# EAGLE schematic TriggerBoardv2 (EAGLE 6.5.0)
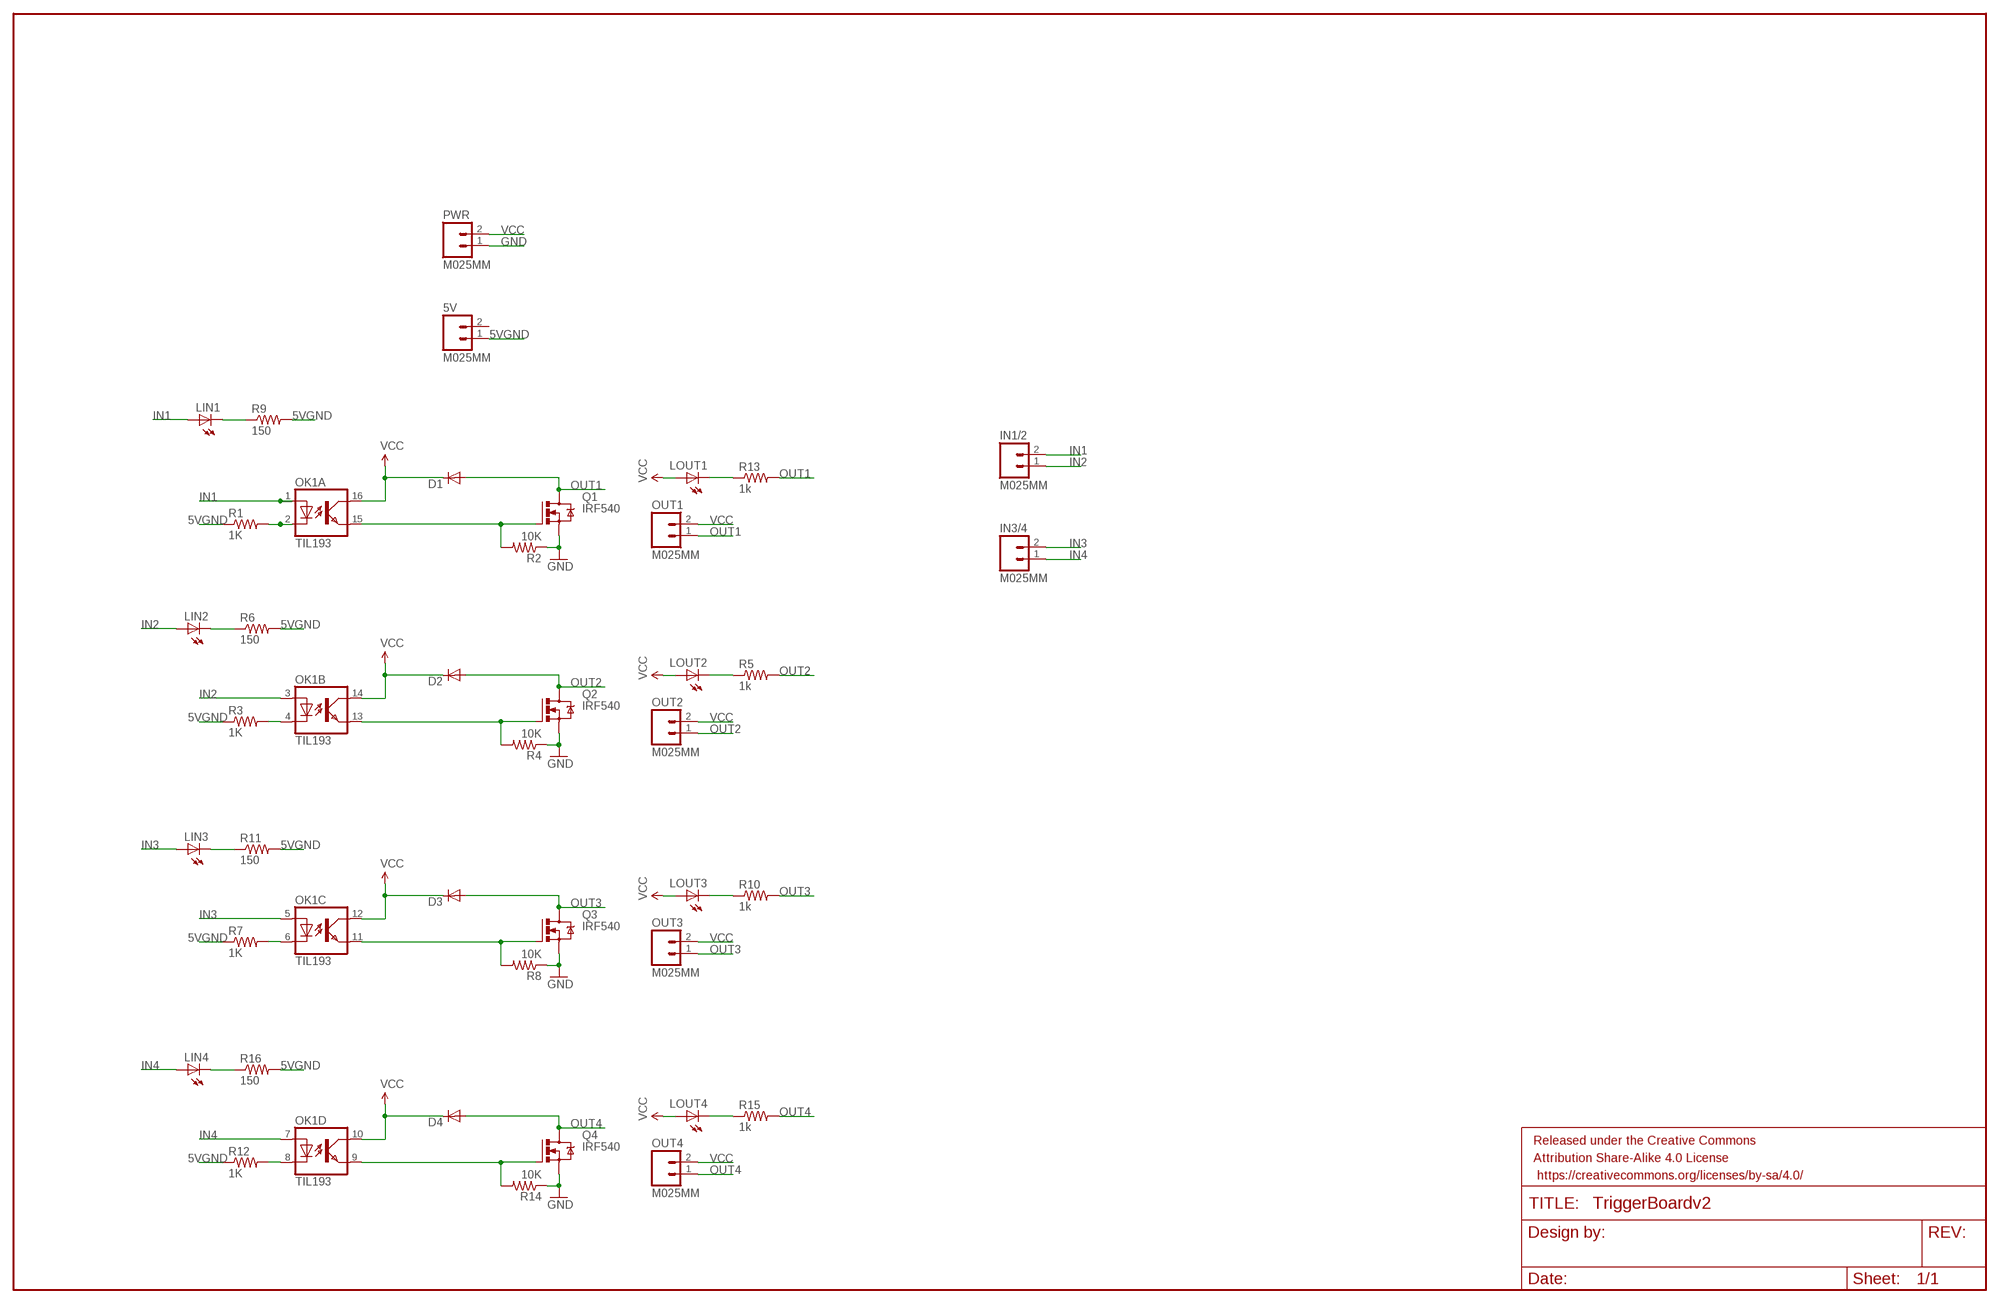
[diagram p0: schematic, sheet 1]

## Parts
5V  M025MM  [SCREWTERMINAL-5MM-2]
D1  DIODEPTH  [DIODE-1N4001]
D2  DIODEPTH  [DIODE-1N4001]
D3  DIODEPTH  [DIODE-1N4001]
D4  DIODEPTH  [DIODE-1N4001]
FRAME1  FRAME-LEDGER  [CREATIVE_COMMONS]
IN1/2  M025MM  [SCREWTERMINAL-5MM-2]
IN3/4  M025MM  [SCREWTERMINAL-5MM-2]
LIN1  LED3MM  [LED3MM]
LIN2  LED3MM  [LED3MM]
LIN3  LED3MM  [LED3MM]
LIN4  LED3MM  [LED3MM]
LOUT1  LED3MM  [LED3MM]
LOUT2  LED3MM  [LED3MM]
LOUT3  LED3MM  [LED3MM]
LOUT4  LED3MM  [LED3MM]
OK1  TIL193  [DIL16]
OUT1  M025MM  [SCREWTERMINAL-5MM-2]
OUT2  M025MM  [SCREWTERMINAL-5MM-2]
OUT3  M025MM  [SCREWTERMINAL-5MM-2]
OUT4  M025MM  [SCREWTERMINAL-5MM-2]
PWR  M025MM  [SCREWTERMINAL-5MM-2]
Q1  IRF540  [TO220BV]
Q2  IRF540  [TO220BV]
Q3  IRF540  [TO220BV]
Q4  IRF540  [TO220BV]
R1  1K  RESISTORPTH-1/4W  [AXIAL-0.4]
R2  10K  RESISTORPTH-1/4W  [AXIAL-0.4]
R3  1K  RESISTORPTH-1/4W  [AXIAL-0.4]
R4  10K  RESISTORPTH-1/4W  [AXIAL-0.4]
R5  1k  RESISTORPTH-1/4W  [AXIAL-0.4]
R6  150  RESISTORPTH-1/4W  [AXIAL-0.4]
R7  1K  RESISTORPTH-1/4W  [AXIAL-0.4]
R8  10K  RESISTORPTH-1/4W  [AXIAL-0.4]
R9  150  RESISTORPTH-1/4W  [AXIAL-0.4]
R10  1k  RESISTORPTH-1/4W  [AXIAL-0.4]
R11  150  RESISTORPTH-1/4W  [AXIAL-0.4]
R12  1K  RESISTORPTH-1/4W  [AXIAL-0.4]
R13  1k  RESISTORPTH-1/4W  [AXIAL-0.4]
R14  10K  RESISTORPTH-1/4W  [AXIAL-0.4]
R15  1k  RESISTORPTH-1/4W  [AXIAL-0.4]
R16  150  RESISTORPTH-1/4W  [AXIAL-0.4]

## Nets
5VGND: 5V.1 R1.P$1 R3.P$1 R6.P$2 R7.P$1 R9.P$2 R11.P$2 R12.P$1 R16.P$2
GND: PWR.1 Q1.S Q2.S Q3.S Q4.S R2.P$1 R4.P$1 R8.P$1 R14.P$1
IN1: IN1/2.2 LIN1.A OK1.1(A:A)
IN2: IN1/2.1 LIN2.A OK1.3(B:A)
IN3: IN3/4.2 LIN3.A OK1.5(C:A)
IN4: IN3/4.1 LIN4.A OK1.7(D:A)
N$1: LOUT1.K(C) R13.P$1
N$2: OK1.4(B:C) R3.P$2
N$3: LIN1.K(C) R9.P$1
N$4: OK1.15(A:EMIT) Q1.G R2.P$2
N$5: OK1.13(B:EMIT) Q2.G R4.P$2
N$6: OK1.2(A:C) R1.P$2
N$7: LOUT2.K(C) R5.P$1
N$8: LIN2.K(C) R6.P$1
N$9: OK1.11(C:EMIT) Q3.G R8.P$2
N$10: LOUT3.K(C) R10.P$1
N$11: OK1.6(C:C) R7.P$2
N$12: LIN3.K(C) R11.P$1
N$13: OK1.9(D:EMIT) Q4.G R14.P$2
N$14: LOUT4.K(C) R15.P$1
N$15: OK1.8(D:C) R12.P$2
N$16: LIN4.K(C) R16.P$1
OUT1: D1.A OUT1.1 Q1.D R13.P$2
OUT2: D2.A OUT2.1 Q2.D R5.P$2
OUT3: D3.A OUT3.1 Q3.D R10.P$2
OUT4: D4.A OUT4.1 Q4.D R15.P$2
VCC: D1.C D2.C D3.C D4.C LOUT1.A LOUT2.A LOUT3.A LOUT4.A OK1.10(D:COL) OK1.12(C:COL) OK1.14(B:COL) OK1.16(A:COL) OUT1.2 OUT2.2 OUT3.2 OUT4.2 PWR.2
Unconnected: 5V.2

## Library data of the parts
5V IN1/2 IN3/4 OUT1-OUT4 PWR = SparkFun-Connectors:M02: Standard 2-pin 0.1" header. Use with - straight break away headers ( PRT-00116) - right angle break away headers (PRT-00553) - swiss pins (PRT-00743) - machine pins (PRT-00117) - female headers (PRT-00115) Molex polarized connector foot print use with: PRT-08233 with associated crimp pins and housings. 2.54_SCREWTERM for use with PRT-10571. 3.5mm Screw Terminal footprints for PRT-08084 5mm Screw Terminal footprints for use with PRT-08433
D1-D4 = SparkFun-DiscreteSemi:DIODE: Diode These are standard reverse protection diodes and small signal diodes. SMA package can handle up to about 1A. SOD-323 can handle about 200mA. What the SOD-323 package when ordering, there are some mfgs out there that are 5-pin packages.
FRAME1 = SparkFun-Aesthetics:FRAME-LEDGER: Schematic Frame Standard 11x14 US Ledger frame
LIN1-LIN4 LOUT1-LOUT4 = SparkFun-LED:LED: LEDs Standard schematic elements and footprints for 5mm, 3mm, 1206, and 0603 sized LEDs. 5mm - Spark Fun Electronics SKU : COM-00529 (and others)
OK1 = optocoupler:TIL193: TEXAS INSTRUMENTS OPTO COUPLER; OC_FARNELL: 1683365; OC_NEWARK: unknown
Q1-Q4 = transistor-power:IRF540: HEXFET Power MOSFET
R1-R16 = SparkFun-Resistors:RESISTOR: Resistor Basic schematic elements and footprints for 0603, 1206, and PTH resistors.